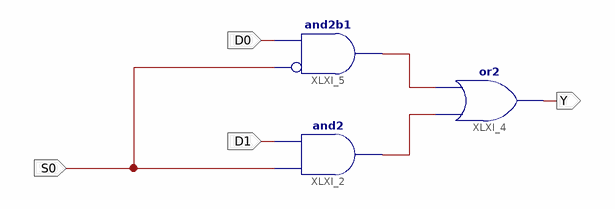
[diagram p0: schematic sheet 1]
// Xilinx ISE schematic MUX_2_T0_1.sch (spartan3e) as structural Verilog: 3 symbols, 4 ports
module MUX_2_T0_1 (
  input  S0,
  input  D0,
  input  D1,
  output Y
);

  wire XLXN_2, XLXN_3;

  and XLXI_2 (XLXN_3, S0, D1);
  or XLXI_4 (Y, XLXN_3, XLXN_2);
  and XLXI_5 (XLXN_2, ~S0, D0);  // and2b1
endmodule
